# Altium schematic sheet Schem_WS_v2.SchDoc: Weather Station ver.2
size A3; DrawnBy: HienPhu; Engineer: HienPhu; Organization: QTech VietNam; Address1: ..........................; Address2: Đà Nẵng; Address3: Việt Nam; Address4: 09/2019; DocumentNumber: 1; Revision: 2.0; SheetNumber: 1; SheetTotal: 2; Time: 11/09/2019
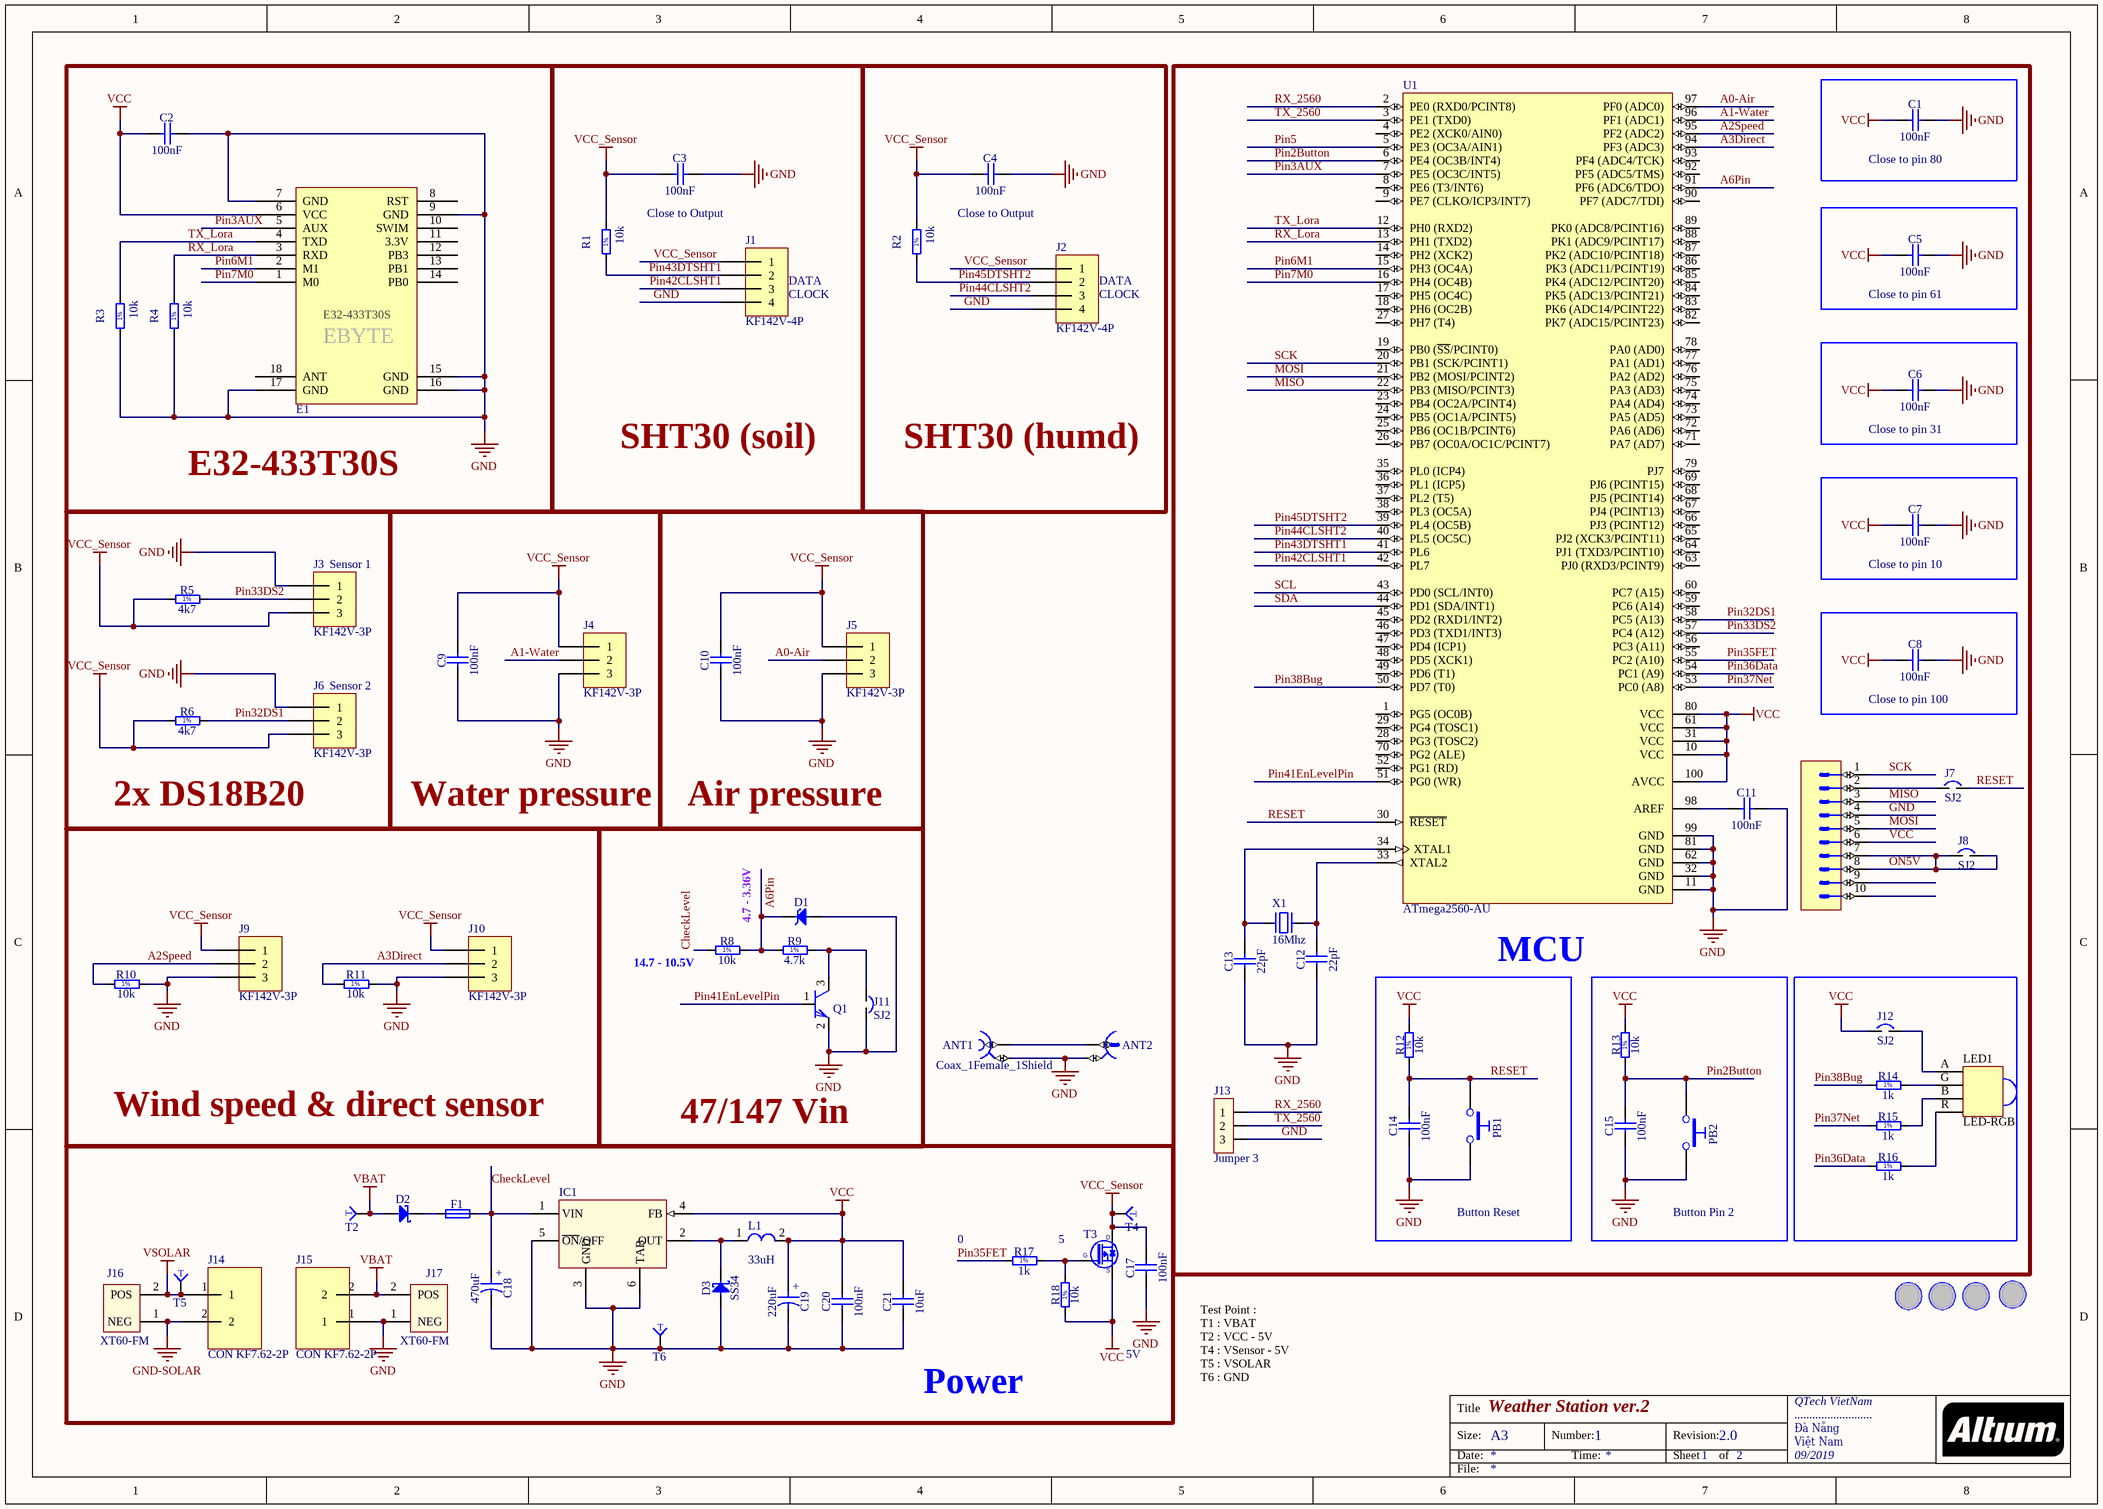
[diagram p0: Schem_WS_v2.SchDoc]

## Parts
ANT1  Coax_1Female_1Shield  [HUBER-SUHNER_85 SMA-50-0-101/111 NE]
ANT2  U.FL  [HIROSE_U.FL-R-SMT-1(10)]  (value not drawn)
C1  100nF  [CAPC1608X87N]
C2  100nF  [CAPC1608X87N]
C3  100nF  [CAPC1608X87N]
C4  100nF  [CAPC1608X87N]
C5  100nF  [CAPC1608X87N]
C6  100nF  [CAPC1608X87N]
C7  100nF  [CAPC1608X87N]
C8  100nF  [CAPC1608X87N]
C9  100nF  [CAPC1608X87N]
C10  100nF  [CAPC1608X87N]
C11  100nF  [CAPC1608X87N]
C12  22pF  [CAPC1608X87N]
C13  22pF  [CAPC1608X87N]
C14  100nF  [CAPC1608X87N]
C15  100nF  [CAPC1608X87N]
C17  100nF  [CAPC1608X87N]
C18  470uF  [CAPAE1030X1020N]
C19  220uF  [CAPMP6032X280N]
C20  100nF  [CAPC1608X87N]
C21  10uF  [CAPC2012X135N]
D1  BZV55-B5V1  [DIOMELF3515N]  (value not drawn)
D2  SS16  [DIOM5127X229N]  (value not drawn)
D3  SS34  [DIOM5127X229N]
E1  E32-T30S  [E32-433T30S]  (value not drawn)
F1  140mA-60V  [FUSRC4632X90N]  (value not drawn)
HOLE1  HOLE  [HOLE M3]  (value not drawn)
HOLE2  HOLE  [HOLE M3]  (value not drawn)
HOLE3  HOLE  [HOLE M3]  (value not drawn)
HOLE4  HOLE  [HOLE M3]  (value not drawn)
IC1  LM2596  [TO263-5]  (value not drawn)
J1  KF142V-4P  [CON KF142V-4P-5.08]
J2  KF142V-4P  [CON KF142V-4P-5.08]
J3  KF142V-3P  [CON KF142V-3P-5.08]
J4  KF142V-3P  [CON KF142V-3P-5.08]
J5  KF142V-3P  [CON KF142V-3P-5.08]
J6  KF142V-3P  [CON KF142V-3P-5.08]
J7  SJ2  [SJ2]
J8  SJ2  [SJ2]
J9  KF142V-3P  [CON KF142V-3P-5.08]
J10  KF142V-3P  [CON KF142V-3P-5.08]
J11  SJ2  [SJ2]
J12  SJ2  [SJ2]
J13  Jumper 3  [JP3]
J14  CON KF7.62-2P  [CON KF7.62-2P]
J15  CON KF7.62-2P  [CON KF7.62-2P]
J16  XT60-FM  [XT60-FM]
J17  XT60-FM  [XT60-FM]
JTAG1  Header 10  [3M_N2510-6002RB]  (value not drawn)
L1  33uH  [L_SMD]
LED1  LED-RGB  [LED-5MMRGBCA]
PB1  Push Button  [PB_TYCO_FSMSM]  (value not drawn)
PB2  Push Button  [PB_TYCO_FSMSM]  (value not drawn)
Q1  C1815  [SOT23]  (value not drawn)
R1  10k  [RESC1608X55N]
R2  10k  [RESC1608X55N]
R3  10k  [RESC1608X55N]
R4  10k  [RESC1608X55N]
R5  4k7  [RESC1608X55N]
R6  4k7  [RESC1608X55N]
R8  10k  [RESC1608X55N]
R9  4.7k  [RESC1608X55N]
R10  10k  [RESC1608X55N]
R11  10k  [RESC1608X55N]
R12  10k  [RESC1608X55N]
R13  10k  [RESC1608X55N]
R14  1k  [RESC1608X55N]
R15  1k  [RESC1608X55N]
R16  1k  [RESC1608X55N]
R17  1k  [RESC1608X55N]
R18  10k  [RESC1608X55N]
T2  Test Point  [TP1x1r]  (value not drawn)
T3  BSH203  [SOT95P230X110-3N]  (value not drawn)
T4  Test Point  [TP1x1r]  (value not drawn)
T5  Test Point  [TP1x1r]  (value not drawn)
T6  Test Point  [TP1x1r]  (value not drawn)
U1  ATmega2560-AU  [TQFP100L]
X1  16Mhz  [XT2]

## Blocks framed on the sheet
E32-433T30S: C2 E1 R3 R4
SHT30 (soil): C3 J1 R1
SHT30 (humd): C4 J2 R2
Button Reset: C11-C13 J7 J8 J12 J13 JTAG1 LED1 R14-R16 U1 X1
Close to pin 80: C1
Close to pin 61: C5
Close to pin 31: C6
Close to pin 10: C7
2x DS18B20: J3 J6 R5 R6
Water pressure: C9 J4
Air pressure: C10 J5
Close to pin 100: C8
Wind speed & direct sensor: J9 J10 R10 R11
47/147 Vin: D1 J11 Q1 R8 R9
MCU: C14 PB1 R12
Button Pin 2: C15 PB2 R13
Power: C17-C21 D2 D3 F1 IC1 J14-J17 L1 R17 R18 T2-T6

## Nets
GND: ANT1.2 ANT2.2 C1.2 C2.2 C3.2 C4.2 C5.2 C6.2 C7.2 C8.2 C9.1 C10.1 C11.2 C12.1 C13.1 C14.1 C15.1 C17.1 C18.2 C19.2 C20.1 C21.1 D1.2(A) D3.2(A) E1.7(GND) E1.9(GND) E1.15(GND) E1.16(GND) E1.17(GND) IC1.3(GND) IC1.5(~{ON}/OFF) IC1.6(TAB) J1.4 J2.4 J3.1 J4.3 J5.3 J6.1 J9.3 J10.3 J11.2 J13.3 J15.1 J17.1(NEG) JTAG1.4 PB1.2 PB2.2 Q1.2(E) R3.1 R4.1 R10.2 R11.2 T6.1 U1.11(GND) U1.32(GND) U1.62(GND) U1.81(GND) U1.99(GND)
GND-SOLAR: J14.2 J16.1(NEG)
VBAT: D2.2(A) J15.2 J17.2(POS) T2.1
VCC: C1.1 C2.1 C5.1 C6.1 C7.1 C8.1 C19.1 C20.2 C21.2 E1.6(VCC) IC1.4(FB) J12.1 JTAG1.6 L1.2 R12.2 R13.2 R18.1 T3.2(S) U1.10(VCC) U1.31(VCC) U1.61(VCC) U1.80(VCC) U1.100(AVCC)
VCC_Sensor: C3.1 C4.1 C9.2 C10.2 C17.2 J1.1 J2.1 J3.3 J4.1 J5.1 J6.3 J9.1 J10.1 R1.2 R2.2 R5.1 R6.1 T3.3(D) T4.1
VSOLAR: J14.1 J16.2(POS) T5.1
A0-Air: J5.2 U1.97(PF0_(ADC0))
A1-Water: J4.2 U1.96(PF1_(ADC1))
A2Speed: J9.2 R10.1 U1.95(PF2_(ADC2))
A3Direct: J10.2 R11.1 U1.94(PF3_(ADC3))
A6Pin: D1.1(C) R8.2 R9.1 U1.91(PF6_(ADC6/TDO))
CheckLevel: C18.1 F1.2 IC1.1(VIN) R8.1
MISO: JTAG1.3 U1.22(PB3_(MISO/PCINT3))
MOSI: JTAG1.5 U1.21(PB2_(MOSI/PCINT2))
ON5V: J8.1 J8.2 JTAG1.7 JTAG1.8
Pin2Button: C15.2 PB2.1 R13.1 U1.6(PE4_(OC3B/INT4))
Pin3AUX: E1.5(AUX) U1.7(PE5_(OC3C/INT5))
Pin5: U1.5(PE3_(OC3A/AIN1))
Pin6M1: E1.2(M1) U1.15(PH3_(OC4A))
Pin7M0: E1.1(M0) U1.16(PH4_(OC4B))
Pin32DS1: J6.2 R6.2 U1.58(PC5_(A13))
Pin33DS2: J3.2 R5.2 U1.57(PC4_(A12))
Pin35FET: R17.1 U1.55(PC2_(A10))
Pin36Data: R16.1 U1.54(PC1_(A9))
Pin37Net: R15.1 U1.53(PC0_(A8))
Pin38Bug: R14.1 U1.50(PD7_(T0))
Pin41EnLevelPin: Q1.1(B) U1.51(PG0_(WR))
Pin42CLSHT1: J1.3 U1.42(PL7)
Pin43DTSHT1: J1.2 R1.1 U1.41(PL6)
Pin44CLSHT2: J2.3 U1.40(PL5_(OC5C))
Pin45DTSHT2: J2.2 R2.1 U1.39(PL4_(OC5B))
RESET: C14.2 J7.2 PB1.1 R12.1 U1.30(~{RESET})
RX_2560: J13.1 U1.2(PE0_(RXD0/PCINT8))
RX_Lora: E1.3(RXD) R4.2 U1.13(PH1_(TXD2))
SCK: JTAG1.1 U1.20(PB1_(SCK/PCINT1))
SCL: U1.43(PD0_(SCL/INT0))
SDA: U1.44(PD1_(SDA/INT1))
TX_2560: J13.2 U1.3(PE1_(TXD0))
TX_Lora: E1.4(TXD) R3.2 U1.12(PH0_(RXD2))
NetANT1_1: ANT1.1 ANT2.1
NetC11_1: C11.1 U1.98(AREF)
NetC12_2: C12.2 U1.33(XTAL2) X1.1
NetC13_2: C13.2 U1.34(XTAL1) X1.2
NetD2_1: D2.1(C) F1.1
NetD3_1: D3.1(C) IC1.2(OUT) L1.1
NetJ7_1: J7.1 JTAG1.2
NetJ11_1: J11.1 Q1.3(C) R9.2
NetJ12_2: J12.2 LED1.A
NetLED1_B: LED1.B R15.2
NetLED1_G: LED1.G R14.2
NetLED1_R: LED1.R R16.2
NetR17_2: R17.2 R18.2 T3.1(G)

Not connected (* = marked no-connect by the designer): E1 8(RST) 10(SWIM) 11(3.3V) 12(PB3) 13(PB1) 14(PB0) 18(ANT); JTAG1 9 10; U1 1(PG5_(OC0B)) 4(PE2_(XCK0/AIN0)) 8(PE6_(T3/INT6)) 9(PE7_(CLKO/ICP3/INT7)) 14(PH2_(XCK2)) 17(PH5_(OC4C)) 18(PH6_(OC2B)) 19(PB0_(~{SS}/PCINT0)) 23(PB4_(OC2A/PCINT4)) 24(PB5_(OC1A/PCINT5)) 25(PB6_(OC1B/PCINT6)) 26(PB7_(OC0A/OC1C/PCINT7)) 27(PH7_(T4)) 28(PG3_(TOSC2)) 29(PG4_(TOSC1)) 35(PL0_(ICP4)) 36(PL1_(ICP5)) 37(PL2_(T5)) 38(PL3_(OC5A)) 45(PD2_(RXD1/INT2)) 46(PD3_(TXD1/INT3)) 47(PD4_(ICP1)) 48(PD5_(XCK1)) 49(PD6_(T1)) 52(PG1_(RD)) 56(PC3_(A11)) 59(PC6_(A14)) 60(PC7_(A15)) 63(PJ0_(RXD3/PCINT9)) 64(PJ1_(TXD3/PCINT10)) 65(PJ2_(XCK3/PCINT11)) 66(PJ3_(PCINT12)) 67(PJ4_(PCINT13)) 68(PJ5_(PCINT14)) 69(PJ6_(PCINT15)) 70(PG2_(ALE)) 71(PA7_(AD7)) 72(PA6_(AD6)) 73(PA5_(AD5)) 74(PA4_(AD4)) 75(PA3_(AD3)) 76(PA2_(AD2)) 77(PA1_(AD1)) 78(PA0_(AD0)) 79(PJ7) 82(PK7_(ADC15/PCINT23)) 83(PK6_(ADC14/PCINT22)) 84(PK5_(ADC13/PCINT21)) 85(PK4_(ADC12/PCINT20)) 86(PK3_(ADC11/PCINT19)) 87(PK2_(ADC10/PCINT18)) 88(PK1_(ADC9/PCINT17)) 89(PK0_(ADC8/PCINT16)) 90(PF7_(ADC7/TDI)) 92(PF5_(ADC5/TMS)) 93(PF4_(ADC4/TCK))

## Notes on the sheet
- Close to Output
- (near J1) DATA
- (near J1) CLOCK
- (near J2) DATA
- (near J2) CLOCK
- (near J3) Sensor 1
- (near J6) Sensor 2
- 4.7 - 3.36V
- (near R8) 14.7 - 10.5V
- 0
- 5
- 5V
- Test Point :
  T1 : VBAT
  T2 : VCC - 5V
  T4 : VSensor - 5V
  T5 : VSOLAR
  T6 : GND
- Title
- Size:
- Date:
- A3
- Number:
- Time:
- Revision:
- Sheet
- of
- File:
- (in symbol CAE1030-1020_470UF_25V_20%) +
- (in symbol CTE6032-28_100UF_6.3V_10%_LESR0075) +
- (in symbol E32-433T30S) EBYTE
- (in symbol R0603_1K_1%_0.1W_100PPM) 1%
- (in symbol R0603_1M_1%_0.1W_100PPM) 1%
- (in symbol R0603_2M_1%_0.1W_100PPM) 1%
- (in symbol R0603_4K7_1%_0.1W_100PPM) 1%
- (in symbol R0603_10K_1%_0.1W_100PPM) 1%
- (in symbol R0603_160R_1%_0.1W_100PPM) 1%
- (in symbol TP R1x1) T

## Library data of the parts
ANT1 = HUBER-SUHNER_85_SMA-50-0-101/111_NE: Part Description: SMA 50 Ohms Right Angle PCB Jack; Manufacturer: HUBER+SUHNER; Table: Miscellaneous; Part Number: HUBER-SUHNER_85_SMA-50-0-101/111_NE; Component Kind: Standard; Component Type: Standard; Pin Count: 2; Family: SMA; Mounted: Yes; Socket: No; SMD: No; Status: None; Manufacturer Part Number: 85_SMA-50-0-101/111_NE; ComponentHeight: 9.6mm; HelpURL: \\cern.ch\dfs\Applications\Altium\Datasheets\HUBER-SUHNER_85 SMA-50-0-101-111 NE.pdf; Author: CERN DEM JLC; CreateDate: 20-Apr-10; LatestRevisionDate: 27-Apr-10
ANT2 = HIROSE_U.FL-R-SMT-1(10): Part Description: Up to 6GHz Ultra Small Surface Mount Male Coaxial Connectors U.FL Series; Manufacturer: HIROSE (HRS); Table: Miscellaneous; Part Number: HIROSE_U.FL-R-SMT-1(10); Component Kind: Standard; Component Type: Standard; Pin Count: 2; Family: U.FL; Mounted: Yes; Socket: No; SMD: Yes; Status: None; Manufacturer Part Number: U.FL-R-SMT-1(10); ComponentHeight: 1.25mm; HelpURL: \\cern.ch\dfs\Applications\Altium\Datasheets\HIROSE_U.FL-R-SMT-1(10).pdf; Author: CERN DEM JLC; CreateDate: 24-Mar-10; LatestRevisionDate: 24-Mar-10
C1-C11 C14 C15 C17 C20 = CC0603_100NF_50V_10%_X7R: Non-polarised capacitor; Part Description: SMD Multilayer Chip Ceramic Capacitor; Manufacturer: GENERIC; Manufacturer1 Part Number: 223858615649; Voltage: 50V; TC: X7R; Tolerance: ±10%; Table: Capacitors SMD; Part Number: CC0603_100NF_50V_10%_X7R; Component Kind: Standard; Component Type: Standard; Pin Count: 2; Value: 100nF; Status: Preferred; Manufacturer Part Number: CC0603_100NF_50V_10%_X7R; Case: 0603; Mounted: Yes; Socket: No; SMD: Yes; Manufacturer1 Example: PHYCOMP; Manufacturer1 ComponentHeight: 0.87mm; HelpURL: \\cern.ch\dfs\Applications\Altium\Datasheets\CC0603_X7R_PHYCOMP.pdf; Author: CERN DEM JLC; CreateDate: 03-Dec-07; LatestRevisionDate: 03-Dec-07
C12 C13 = CC0603_22PF_50V_5%_NP0: Non-polarised capacitor; Part Description: SMD Multilayer Chip Ceramic Capacitor; Manufacturer: GENERIC; Manufacturer1 Part Number: 223886715229; Voltage: 50V; TC: NP0; Tolerance: ±5%; Table: Capacitors SMD; Part Number: CC0603_22PF_50V_5%_NP0; Component Kind: Standard; Component Type: Standard; Pin Count: 2; Value: 22pF; Status: Preferred; Manufacturer Part Number: CC0603_22PF_50V_5%_NP0; Case: 0603; Mounted: Yes; Socket: No; SMD: Yes; Manufacturer1 Example: PHYCOMP; Manufacturer1 ComponentHeight: 0.87mm; HelpURL: \\cern.ch\dfs\Applications\Altium\Datasheets\CC0603_NP0_PHYCOMP.pdf; Author: CERN DEM JLC; CreateDate: 03-Dec-07; LatestRevisionDate: 03-Dec-07
C18 = CAE1030-1020_470UF_25V_20%: Polarised capacitor; Part Description: Aluminum Electrolytic SMT Capacitor; Manufacturer: GENERIC; Manufacturer1 Part Number: EEEFK1E471AP; Voltage: 25V; Tolerance: ±20%; Table: Capacitors SMD; Part Number: CAE1030-1020_470UF_25V_20%; Component Kind: Standard; Component Type: Standard; Pin Count: 2; Value: 470uF; Status: Not Recommended; Manufacturer Part Number: CAE1030-1020_470UF_25V_20%; Case: G; Mounted: Yes; Socket: No; SMD: Yes; Manufacturer1 Example: PANASONIC; Manufacturer1 ComponentHeight: 10.2mm; HelpURL: \\cern.ch\dfs\Applications\Altium\Datasheets\CAE_PANASONIC_FK.pdf; Author: CERN DEM JLC; CreateDate: 03-Dec-07; LatestRevisionDate: 03-Dec-07
C19 = CTE6032-28_100UF_6.3V_10%_LESR0075: Polarised capacitor; Part Description: Low ESR 0R075 Solid Tantalum Chip Capacitor; Manufacturer: GENERIC; Manufacturer1 Part Number: TPSC107K006R0075; Value: 100uF; Voltage: 6.3V; Tolerance: ±10%; Table: Capacitors SMD; Part Number: CTE6032-28_100UF_6.3V_10%_LESR0075; Component Kind: Standard; Component Type: Standard; Pin Count: 2; Status: Preferred; Manufacturer Part Number: CTE6032-28_100UF_6.3V_10%_LESR0075; Case: C; Mounted: Yes; Socket: No; SMD: Yes; Manufacturer1 Example: AVX; Manufacturer1 ComponentHeight: 2.8mm; HelpURL: \\cern.ch\dfs\Applications\Altium\Datasheets\CTE-LESR_AVX_TPS.pdf; Author: CERN DEM JLC; CreateDate: 05-May-08; LatestRevisionDate: 20-Jan-09
C21 = CC0805_10UF_16V_10%_X5R: Non-polarised capacitor; Part Description: SMD Multilayer Chip Ceramic Capacitor; Manufacturer: GENERIC; Manufacturer1 Part Number: C0805C106K4PAC; Voltage: 16V; TC: X5R; Tolerance: ±10%; Table: Capacitors SMD; Part Number: CC0805_10UF_16V_10%_X5R; Component Kind: Standard; Component Type: Standard; Pin Count: 2; Value: 10uF; Status: Preferred; Manufacturer Part Number: CC0805_10UF_16V_10%_X5R; Case: 0805; Mounted: Yes; Socket: No; SMD: Yes; Manufacturer1 Example: KEMET; Manufacturer1 ComponentHeight: 1.4mm; HelpURL: \\cern.ch\dfs\Applications\Altium\Datasheets\CC1206_X5R_KEMET.pdf; Author: CERN DEM JLC; CreateDate: 03-Dec-07; LatestRevisionDate: 03-Dec-07
D1 = BZV55-B5V1: Zener Diode; Part Description: Voltage Regulator Diode; Manufacturer: NXP SEMICONDUCTORS; Voltage: 5V1; Power: 500mW; Table: Diodes; Part Number: BZV55-B5V1; Component Kind: Standard; Component Type: Standard; Device: BZV55-B5V1; PackageDescription: SOD80C, MELF Diode, 2-Leads, Body 3.5x1.5mm, IPC Medium Density; Manufacturer Part Number: BZV55-B5V1; Pin Count: 2; Case: SOD-80C; Mounted: Yes; Socket: No; SMD: Yes; ComponentHeight: 1.6mm; HelpURL: \\cern.ch\dfs\Applications\Altium\Datasheets\BZV55.pdf; Author: CERN DEM JLC; CreateDate: 06-May-08; LatestRevisionDate: 06-May-08
D2 = SS16: Schottky Diode; Part Description: Surface Mount Schottky Barrier Rectifier; Manufacturer: VISHAY GENERAL SEMICONDUCTOR; Voltage: 60V; Power: 1A; Table: Diodes; Part Number: SS16; Component Kind: Standard; Component Type: Standard; Device: SS16; PackageDescription: DO-214-AC Molded Diode, Body 5.1x2.7mm, IPC Medium Density; Manufacturer Part Number: SS16; Pin Count: 2; Case: DO-214AC; Mounted: Yes; Socket: No; SMD: Yes; ComponentHeight: 2.29mm; HelpURL: \\cern.ch\dfs\Applications\Altium\Datasheets\SS16.pdf; Author: CERN DEM JLC; CreateDate: 15-Jul-08; LatestRevisionDate: 23-Aug-10
D3 = SS16: Schottky Diode; Part Number: SS16; Part Description: Surface Mount Schottky Barrier Rectifier; Manufacturer: VISHAY GENERAL SEMICONDUCTOR; Voltage: 60V; Power: 1A; Table: Diodes; Component Kind: Standard; Component Type: Standard; Device: SS16; PackageDescription: DO-214-AC Molded Diode, Body 5.1x2.7mm, IPC Medium Density; Manufacturer Part Number: SS16; Pin Count: 2; Case: DO-214AC; Mounted: Yes; Socket: No; SMD: Yes; ComponentHeight: 2.29mm; HelpURL: \\cern.ch\dfs\Applications\Altium\Datasheets\SS16.pdf; Author: CERN DEM JLC; CreateDate: 15-Jul-08; LatestRevisionDate: 23-Aug-10
E1 = E32-433T30S: Lora Ebyte E32-T30S Module
F1 = FUSR1812_TYCO-MINISMDC014F: Fuse; Part Description: PolySwitch® PTC Overcurrent Protection Device; Manufacturer: TYCO ELECTRONICS; Table: Fuses; Part Number: FUSR1812_TYCO-MINISMDC014F; Component Kind: Standard; Component Type: Standard; Pin Count: 2; PackageDescription: Chip Resettable Fuse, 2-Leads, Body 4.6x3.2mm, IPC Medium Density; Family: Fuses Resettable; Mounted: Yes; Socket: No; SMD: Yes; Value: 140mA-60V; Manufacturer Part Number: miniSMDC014F; ComponentHeight: 0.89mm; HelpURL: \\cern.ch\dfs\Applications\Altium\Datasheets\FUSR_TYCO_MiniSMDC014F.pdf; Author: CERN DEM JLC; CreateDate: 02-Jul-08; LatestRevisionDate: 10-Oct-12
HOLE1-HOLE4 = HOLE M3
IC1 = LM2596-5V
J1 J2 = CON KF142V-4P-5.08
J3-J6 J9 J10 = CON KF142V-3P-5.08
J7 J8 J11 J12 = SJ2: Solder Jump2
J13 = JP3: Value: J3
J16 J17 = XT60-FM: MF: AMASS; MP: XT60-M; SnapEDA_Link: https://www.snapeda.com/parts/XT60-M/AMASS/view-part/?ref=snap; Price: None; Availability: Unavailable; Package: Package Analog Devices; Value: *
JTAG1 = 3M_N2510-6002RB: Connector 10 Male; Part Description: 10 Contacts - Straight .100'' x .100'' Low Profile Four-Wall Header, 2500 Serie; Manufacturer: 3M; Part Number: 3M_N2510-6002RB; Component Kind: Standard; Component Type: Standard; Pin Count: 10; Family: Header 10; Mounted: Yes; Socket: No; SMD: No; Status: None; Manufacturer Part Number: N2510-6002RB; ComponentHeight: 10.03mm; HelpURL: \\cern.ch\dfs\Applications\Altium\Datasheets\3M_N2510-6002RB.pdf; Author: CERN DEM JLC; CreateDate: 11-Feb-09; LatestRevisionDate: 11-Aug-09; Table: 3M
L1 = L_SMD 33uH
PB1 PB2 = PB SPST 1NO-2NO: Push-Button Switch SPDT; Part Description: 12VDC 50mA SPST Tactile  Push-Button Switch; Manufacturer: TYCO ELECTRONICS; Manufacturer Part Number: FSMSM or 1437566-3; Table: Switches; Part Number: PB_TYCO_FSMSM; Component Kind: Standard; Component Type: Standard; Pin Count: 2; PackageDescription: Body 3.5x6.0mm, Pushbutton Switch,  TYCO ALCOSWITCH FSMSM Serie; Family: Push Button; Mounted: Yes; Socket: No; SMD: Yes; Status: None; ComponentHeight: 4.3mm; HelpURL: \\cern.ch\dfs\Applications\Altium\Datasheets\PB_TYCO_FSMSM.pdf; Author: CERN DEM JLC; CreateDate: 6/30/2008; LatestRevisionDate: 6/21/2012
Q1 = C1815: Q2SC1815; PSpiceTemplate: Q^@REFDES %c %b %e @MODEL; Vendor: Digikey; COMPONENT: 2SC1815; Published: 13-April-2009; Publisher: Hoang Nguyen; ComponentLink1Description: Digikey Part Link; ComponentLink2Description: Open Datasheet; ComponentLink2URL: H:\LIBRARY\LIBRARY.Datasheet\; Price: 500VND
R1-R4 R12 R13 R18 = R0603_10K_1%_0.1W_100PPM: Resistor - 1%; Part Description: General Purpose Thick Film Chip Resistor; Manufacturer: GENERIC; Manufacturer1 Part Number: NRC06F1002TRF; Power: 0.1W; TC: ±100ppm/°C; Table: Resistors SMD; Part Number: R0603_10K_1%_0.1W_100PPM; Component Kind: Standard; Component Type: Standard; Pin Count: 2; Value: 10k; Status: Preferred; Tolerance: ±1%; Manufacturer Part Number: R0603_10K_1%_0.1W_100PPM; Case: 0603; Mounted: Yes; Socket: No; SMD: Yes; Manufacturer1 Example: NIC COMPONENT; Manufacturer1 ComponentHeight: 0.55mm; HelpURL: \\cern.ch\dfs\Applications\Altium\Datasheets\R0603_NIC_NRC.pdf; Author: CERN DEM JLC; CreateDate: 03-Dec-07; LatestRevisionDate: 13-Mar-08
R5 R6 = R0603_4K7_1%_0.1W_100PPM: Resistor - 1%; Part Description: General Purpose Thick Film Chip Resistor; Manufacturer: GENERIC; Manufacturer1 Part Number: NRC06F4701TRF; Power: 0.1W; TC: ±100ppm/°C; Table: Resistors SMD; Part Number: R0603_4K7_1%_0.1W_100PPM; Component Kind: Standard; Component Type: Standard; Pin Count: 2; Value: 4k7; Status: Preferred; Tolerance: ±1%; Manufacturer Part Number: R0603_4K7_1%_0.1W_100PPM; Case: 0603; Mounted: Yes; Socket: No; SMD: Yes; Manufacturer1 Example: NIC COMPONENT; Manufacturer1 ComponentHeight: 0.55mm; HelpURL: \\cern.ch\dfs\Applications\Altium\Datasheets\R0603_NIC_NRC.pdf; Author: CERN DEM JLC; CreateDate: 03-Dec-07; LatestRevisionDate: 13-Mar-08
R8 = R0603_2M_1%_0.1W_100PPM: Resistor - 1%; Part Description: General Purpose Thick Film Chip Resistor; Manufacturer: GENERIC; Manufacturer1 Part Number: NRC06F2004TRF; Value: 2M; Power: 0.1W; TC: ±100ppm/°C; Table: Resistors SMD; Part Number: R0603_2M_1%_0.1W_100PPM; Component Kind: Standard; Component Type: Standard; Pin Count: 2; Status: Preferred; Tolerance: ±1%; Manufacturer Part Number: R0603_2M_1%_0.1W_100PPM; Case: 0603; Mounted: Yes; Socket: No; SMD: Yes; Manufacturer1 Example: NIC COMPONENT; Manufacturer1 ComponentHeight: 0.55mm; HelpURL: \\cern.ch\dfs\Applications\Altium\Datasheets\R0603_NIC_NRC.pdf; Author: CERN DEM JLC; CreateDate: 03-Dec-07; LatestRevisionDate: 13-Mar-08
R9 = R0603_1M_1%_0.1W_100PPM: Resistor - 1%; Part Description: General Purpose Thick Film Chip Resistor; Manufacturer: GENERIC; Manufacturer1 Part Number: NRC06F1004TRF; Value: 1M; Power: 0.1W; TC: ±100ppm/°C; Table: Resistors SMD; Part Number: R0603_1M_1%_0.1W_100PPM; Component Kind: Standard; Component Type: Standard; Pin Count: 2; Status: Preferred; Tolerance: ±1%; Manufacturer Part Number: R0603_1M_1%_0.1W_100PPM; Case: 0603; Mounted: Yes; Socket: No; SMD: Yes; Manufacturer1 Example: NIC COMPONENT; Manufacturer1 ComponentHeight: 0.55mm; HelpURL: \\cern.ch\dfs\Applications\Altium\Datasheets\R0603_NIC_NRC.pdf; Author: CERN DEM JLC; CreateDate: 03-Dec-07; LatestRevisionDate: 13-Mar-08
R10 R11 = R0603_160R_1%_0.1W_100PPM: Resistor - 1%; Part Description: General Purpose Thick Film Chip Resistor; Manufacturer: GENERIC; Manufacturer1 Part Number: NRC06F1600TRF; Value: 160; Power: 0.1W; TC: ±100ppm/°C; Table: Resistors SMD; Part Number: R0603_160R_1%_0.1W_100PPM; Component Kind: Standard; Component Type: Standard; Pin Count: 2; Status: Preferred; Tolerance: ±1%; Manufacturer Part Number: R0603_160R_1%_0.1W_100PPM; Case: 0603; Mounted: Yes; Socket: No; SMD: Yes; Manufacturer1 Example: NIC COMPONENT; Manufacturer1 ComponentHeight: 0.55mm; HelpURL: \\cern.ch\dfs\Applications\Altium\Datasheets\R0603_NIC_NRC.pdf; Author: CERN DEM JLC; CreateDate: 03-Dec-07; LatestRevisionDate: 13-Mar-08
R14-R17 = R0603_1K_1%_0.1W_100PPM: Resistor - 1%; Part Description: General Purpose Thick Film Chip Resistor; Manufacturer: GENERIC; Manufacturer1 Part Number: NRC06F1001TRF; Power: 0.1W; TC: ±100ppm/°C; Table: Resistors SMD; Part Number: R0603_1K_1%_0.1W_100PPM; Component Kind: Standard; Component Type: Standard; Pin Count: 2; Value: 1k; Status: Preferred; Tolerance: ±1%; Manufacturer Part Number: R0603_1K_1%_0.1W_100PPM; Case: 0603; Mounted: Yes; Socket: No; SMD: Yes; Manufacturer1 Example: NIC COMPONENT; Manufacturer1 ComponentHeight: 0.55mm; HelpURL: \\cern.ch\dfs\Applications\Altium\Datasheets\R0603_NIC_NRC.pdf; Author: CERN DEM JLC; CreateDate: 03-Dec-07; LatestRevisionDate: 13-Mar-08
T2 T4-T6 = TP R1x1: Test Point Round 1x1 mm
T3 = BSH203: P-CHANNEL MOSFET WITH DIODE; Part Description: -30V -470mA P-Channel Enhancement Mode MOS Transistor; Manufacturer: NXP SEMICONDUCTORS; Table: Transistors; Part Number: BSH203; Component Kind: Standard; Component Type: Standard; Device: BSH203; PackageDescription: SOT23, 3 pin, Pitch 0.95mm - 1.3mm W X 2.9mm L X 1.1mm H, IPC Medium Density; Manufacturer Part Number: BSH203; Pin Count: 3; Case: SOT23-3; Mounted: Yes; Socket: No; SMD: Yes; ComponentHeight: 1.1mm; HelpURL: \\cern.ch\dfs\Applications\Altium\Datasheets\BSH203.pdf; Author: CERN DEM JLC; CreateDate: 10-May-10; LatestRevisionDate: 10-May-10
U1 = ATmega2560-AU: 8-bit AVR Microcontroller, 4.5-5.5V, 256KB Flash, 4KB EEPROM, 8KB SRAM, 86 GPIO pins, 100-pin TQFP, Industrial Grade (-40°C to 85°C), Pb-Free; Supplier 1: Digi-Key; Supplier Part Number 1: ATMEGA2560-16AUR-ND
X1 = XT2: Crystal, 32.768 KHz, -40 to 85 degC, 3.2 x 1.5 x 0.9 mm SMD; Value: 4Mhz